# Altium schematic sheet Lamp Matrix and GI Driver.SchDoc
size A3 portrait; Organization: Altium Limited; Address1: L3, 12a Rodborough Rd; Address2: Frenchs Forest; Address3: NSW; Address4: Australia 2086
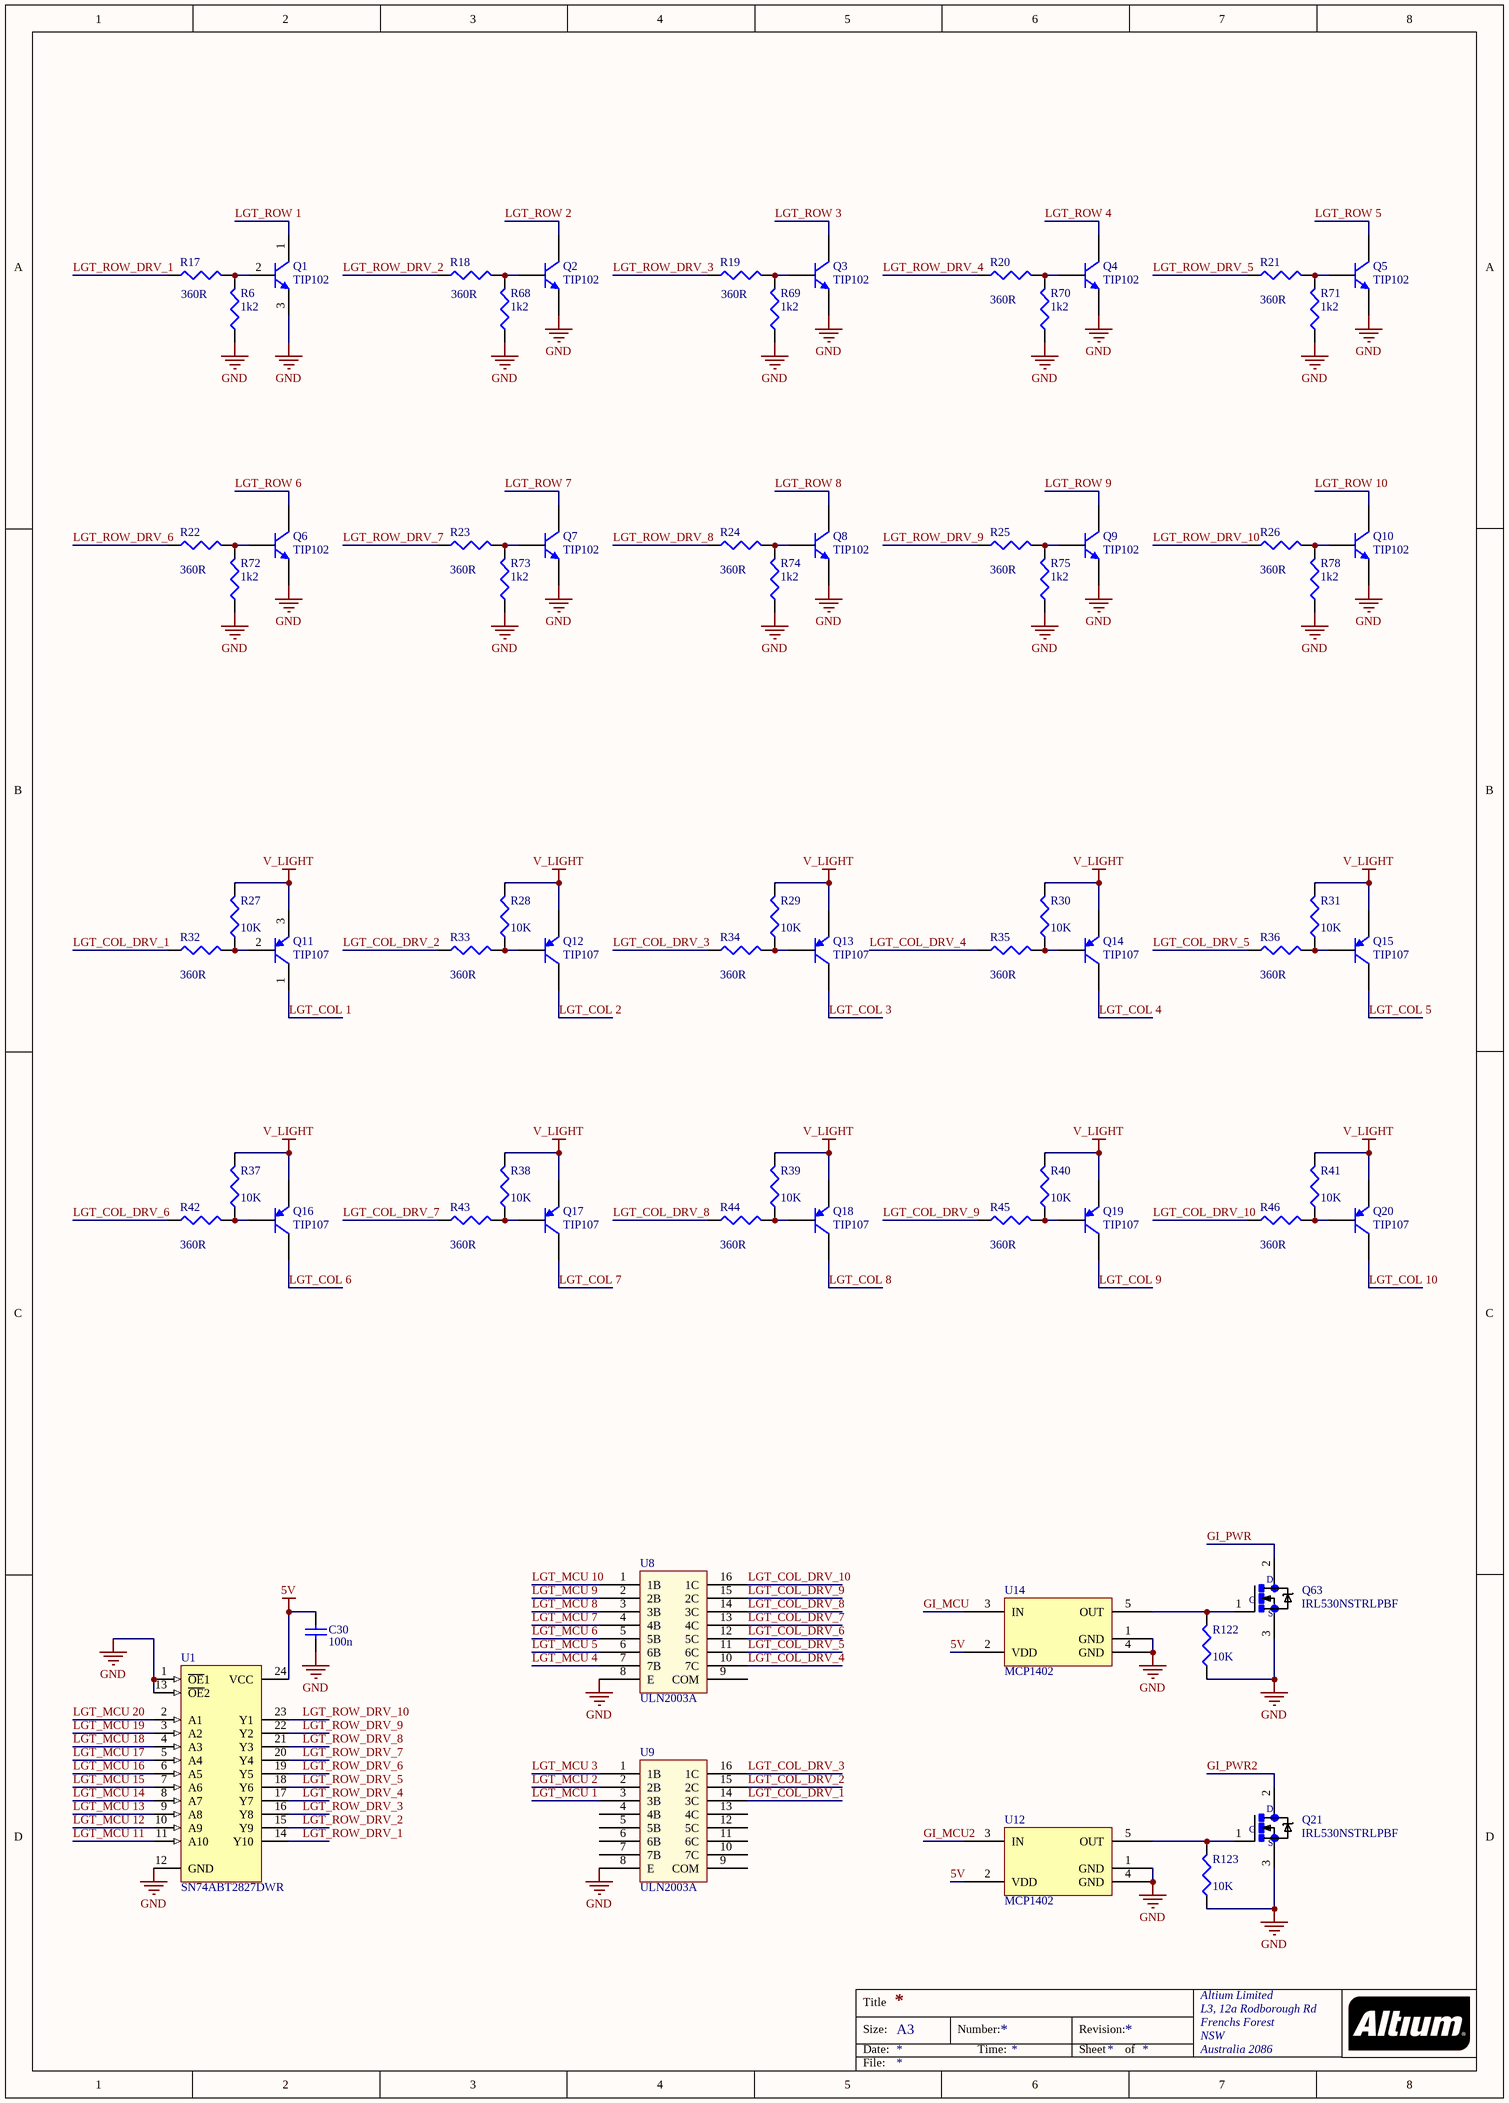
[diagram p0: Lamp Matrix and GI Driver.SchDoc]

## Parts
C30  value 100n  [0805C-GENERIC]  (hidden comment: Cap Semi)
Q1  TIP102  [TO-220AB]
Q2  TIP102  [TO-220AB]
Q3  TIP102  [TO-220AB]
Q4  TIP102  [TO-220AB]
Q5  TIP102  [TO-220AB]
Q6  TIP102  [TO-220AB]
Q7  TIP102  [TO-220AB]
Q8  TIP102  [TO-220AB]
Q9  TIP102  [TO-220AB]
Q10  TIP102  [TO-220AB]
Q11  TIP107  [TO-220AB]
Q12  TIP107  [TO-220AB]
Q13  TIP107  [TO-220AB]
Q14  TIP107  [TO-220AB]
Q15  TIP107  [TO-220AB]
Q16  TIP107  [TO-220AB]
Q17  TIP107  [TO-220AB]
Q18  TIP107  [TO-220AB]
Q19  TIP107  [TO-220AB]
Q20  TIP107  [TO-220AB]
Q21  IRL530NSTRLPBF  [TO-220AB]
Q63  IRL530NSTRLPBF  [TO-220AB]
R6  value 1k2  [0805R-GENERIC]  (hidden comment: Res3)
R17  value 360R  [0805R-GENERIC]  (hidden comment: Res3)
R18  value 360R  [0805R-GENERIC]  (hidden comment: Res3)
R19  value 360R  [0805R-GENERIC]  (hidden comment: Res3)
R20  value 360R  [0805R-GENERIC]  (hidden comment: Res3)
R21  value 360R  [0805R-GENERIC]  (hidden comment: Res3)
R22  value 360R  [0805R-GENERIC]  (hidden comment: Res3)
R23  value 360R  [0805R-GENERIC]  (hidden comment: Res3)
R24  value 360R  [0805R-GENERIC]  (hidden comment: Res3)
R25  value 360R  [0805R-GENERIC]  (hidden comment: Res3)
R26  value 360R  [0805R-GENERIC]  (hidden comment: Res3)
R27  value 10K  [0805R-GENERIC]  (hidden comment: Res3)
R28  value 10K  [0805R-GENERIC]  (hidden comment: Res3)
R29  value 10K  [0805R-GENERIC]  (hidden comment: Res3)
R30  value 10K  [0805R-GENERIC]  (hidden comment: Res3)
R31  value 10K  [0805R-GENERIC]  (hidden comment: Res3)
R32  value 360R  [0805R-GENERIC]  (hidden comment: Res3)
R33  value 360R  [0805R-GENERIC]  (hidden comment: Res3)
R34  value 360R  [0805R-GENERIC]  (hidden comment: Res3)
R35  value 360R  [0805R-GENERIC]  (hidden comment: Res3)
R36  value 360R  [0805R-GENERIC]  (hidden comment: Res3)
R37  value 10K  [0805R-GENERIC]  (hidden comment: Res3)
R38  value 10K  [0805R-GENERIC]  (hidden comment: Res3)
R39  value 10K  [0805R-GENERIC]  (hidden comment: Res3)
R40  value 10K  [0805R-GENERIC]  (hidden comment: Res3)
R41  value 10K  [0805R-GENERIC]  (hidden comment: Res3)
R42  value 360R  [0805R-GENERIC]  (hidden comment: Res3)
R43  value 360R  [0805R-GENERIC]  (hidden comment: Res3)
R44  value 360R  [0805R-GENERIC]  (hidden comment: Res3)
R45  value 360R  [0805R-GENERIC]  (hidden comment: Res3)
R46  value 360R  [0805R-GENERIC]  (hidden comment: Res3)
R68  value 1k2  [0805R-GENERIC]  (hidden comment: Res3)
R69  value 1k2  [0805R-GENERIC]  (hidden comment: Res3)
R70  value 1k2  [0805R-GENERIC]  (hidden comment: Res3)
R71  value 1k2  [0805R-GENERIC]  (hidden comment: Res3)
R72  value 1k2  [0805R-GENERIC]  (hidden comment: Res3)
R73  value 1k2  [0805R-GENERIC]  (hidden comment: Res3)
R74  value 1k2  [0805R-GENERIC]  (hidden comment: Res3)
R75  value 1k2  [0805R-GENERIC]  (hidden comment: Res3)
R78  value 1k2  [0805R-GENERIC]  (hidden comment: Res3)
R122  value 10K  [0805R-GENERIC]  (hidden comment: Res3)
R123  value 10K  [0805R-GENERIC]  (hidden comment: Res3)
U1  SN74ABT2827DWR  [SOIC24]
U8  ULN2003A  [SOIC16]
U9  ULN2003A  [SOIC16]
U12  MCP1402  [SOT23-5]
U14  MCP1402  [SOT23-5]

## Nets
5V: C30.2 U1.24(VCC) U12.2(VDD) U14.2(VDD)
GND: C30.1 Q1.3(E) Q2.3(E) Q3.3(E) Q4.3(E) Q5.3(E) Q6.3(E) Q7.3(E) Q8.3(E) Q9.3(E) Q10.3(E) Q21.3(S) Q63.3(S) R6.1 R68.1 R69.1 R70.1 R71.1 R72.1 R73.1 R74.1 R75.1 R78.1 R122.1 R123.1 U1.1(~{OE}1) U1.12(GND) U1.13(~{OE}2) U8.8(E) U9.8(E) U12.1(GND) U12.4(GND) U14.1(GND) U14.4(GND)
V_LIGHT: Q11.3(E) Q12.3(E) Q13.3(E) Q14.3(E) Q15.3(E) Q16.3(E) Q17.3(E) Q18.3(E) Q19.3(E) Q20.3(E) R27.2 R28.2 R29.2 R30.2 R31.2 R37.2 R38.2 R39.2 R40.2 R41.2
GI_MCU: U14.3(IN)
GI_MCU2: U12.3(IN)
GI_PWR: Q63.2(D)
GI_PWR2: Q21.2(D)
LGT_COL 1: Q11.1(C)
LGT_COL 2: Q12.1(C)
LGT_COL 3: Q13.1(C)
LGT_COL 4: Q14.1(C)
LGT_COL 5: Q15.1(C)
LGT_COL 6: Q16.1(C)
LGT_COL 7: Q17.1(C)
LGT_COL 8: Q18.1(C)
LGT_COL 9: Q19.1(C)
LGT_COL 10: Q20.1(C)
LGT_COL_DRV_1: R32.1 U9.14(3C)
LGT_COL_DRV_2: R33.1 U9.15(2C)
LGT_COL_DRV_3: R34.1 U9.16(1C)
LGT_COL_DRV_4: R35.1 U8.10(7C)
LGT_COL_DRV_5: R36.1 U8.11(6C)
LGT_COL_DRV_6: R42.1 U8.12(5C)
LGT_COL_DRV_7: R43.1 U8.13(4C)
LGT_COL_DRV_8: R44.1 U8.14(3C)
LGT_COL_DRV_9: R45.1 U8.15(2C)
LGT_COL_DRV_10: R46.1 U8.16(1C)
LGT_MCU 1: U9.3(3B)
LGT_MCU 2: U9.2(2B)
LGT_MCU 3: U9.1(1B)
LGT_MCU 4: U8.7(7B)
LGT_MCU 5: U8.6(6B)
LGT_MCU 6: U8.5(5B)
LGT_MCU 7: U8.4(4B)
LGT_MCU 8: U8.3(3B)
LGT_MCU 9: U8.2(2B)
LGT_MCU 10: U8.1(1B)
LGT_MCU 11: U1.11(A10)
LGT_MCU 12: U1.10(A9)
LGT_MCU 13: U1.9(A8)
LGT_MCU 14: U1.8(A7)
LGT_MCU 15: U1.7(A6)
LGT_MCU 16: U1.6(A5)
LGT_MCU 17: U1.5(A4)
LGT_MCU 18: U1.4(A3)
LGT_MCU 19: U1.3(A2)
LGT_MCU 20: U1.2(A1)
LGT_ROW 1: Q1.1(C)
LGT_ROW 2: Q2.1(C)
LGT_ROW 3: Q3.1(C)
LGT_ROW 4: Q4.1(C)
LGT_ROW 5: Q5.1(C)
LGT_ROW 6: Q6.1(C)
LGT_ROW 7: Q7.1(C)
LGT_ROW 8: Q8.1(C)
LGT_ROW 9: Q9.1(C)
LGT_ROW 10: Q10.1(C)
LGT_ROW_DRV_1: R17.1 U1.14(Y10)
LGT_ROW_DRV_2: R18.1 U1.15(Y9)
LGT_ROW_DRV_3: R19.1 U1.16(Y8)
LGT_ROW_DRV_4: R20.1 U1.17(Y7)
LGT_ROW_DRV_5: R21.1 U1.18(Y6)
LGT_ROW_DRV_6: R22.1 U1.19(Y5)
LGT_ROW_DRV_7: R23.1 U1.20(Y4)
LGT_ROW_DRV_8: R24.1 U1.21(Y3)
LGT_ROW_DRV_9: R25.1 U1.22(Y2)
LGT_ROW_DRV_10: R26.1 U1.23(Y1)
NetQ1_2: Q1.2(B) R6.2 R17.2
NetQ2_2: Q2.2(B) R18.2 R68.2
NetQ3_2: Q3.2(B) R19.2 R69.2
NetQ4_2: Q4.2(B) R20.2 R70.2
NetQ5_2: Q5.2(B) R21.2 R71.2
NetQ6_2: Q6.2(B) R22.2 R72.2
NetQ7_2: Q7.2(B) R23.2 R73.2
NetQ8_2: Q8.2(B) R24.2 R74.2
NetQ9_2: Q9.2(B) R25.2 R75.2
NetQ10_2: Q10.2(B) R26.2 R78.2
NetQ11_2: Q11.2(B) R27.1 R32.2
NetQ12_2: Q12.2(B) R28.1 R33.2
NetQ13_2: Q13.2(B) R29.1 R34.2
NetQ14_2: Q14.2(B) R30.1 R35.2
NetQ15_2: Q15.2(B) R31.1 R36.2
NetQ16_2: Q16.2(B) R37.1 R42.2
NetQ17_2: Q17.2(B) R38.1 R43.2
NetQ18_2: Q18.2(B) R39.1 R44.2
NetQ19_2: Q19.2(B) R40.1 R45.2
NetQ20_2: Q20.2(B) R41.1 R46.2
NetQ21_1: Q21.1(G) R123.2 U12.5(OUT)
NetQ63_1: Q63.1(G) R122.2 U14.5(OUT)

Not connected (* = marked no-connect by the designer): U8 9(COM); U9 4(4B) 5(5B) 6(6B) 7(7B) 9(COM) 10(7C) 11(6C) 12(5C) 13(4C)

## Notes on the sheet
- Title
- Size:
- Date:
- A3
- Number:
- Time:
- Revision:
- Sheet
- of
- File:

## Library data of the parts
C30 = Cap Semi: Capacitor (Semiconductor SIM Model); Published: 8-Jun-2000; LatestRevisionDate: 29-May-2009; LatestRevisionNote: IPC-7351 Footprint Added.; PackageReference: C1206; Publisher: Altium Limited; PackageDescription: Chip Capacitor
Q1-Q10 = NPN: NPN Bipolar Transistor; pin to pad: 1>2 2>1; Published: 8-Jun-2000; LatestRevisionDate: 17-Jul-2002; LatestRevisionNote: Re-released for DXP Platform.; PackageReference: TO-226-AA; Publisher: Altium Limited; PackageDescription: TO, Flat Index; 3 In-Line, Axial Leads; Body Dia. 4.8mm; Leads 0.55 x 0.51 mm (max); Code_JEDEC: TO-226-AA
Q11-Q20 = PNP: PNP Bipolar Transistor; pin to pad: 1>2 2>1; Published: 8-Jun-2000; LatestRevisionDate: 29-May-2009; LatestRevisionNote: IPC-7351 Footprint Added.; PackageVersion: Aug-1999; PackageReference: SOT-23B; Publisher: Altium Limited; PackageDescription: 3-Pin SOT-23 Package 0.95 mm Pitch, 2.4 mm Lead Span
Q21 Q63 = IRL530NSTRLPBF: MOSFET N-CH 100V 17A D2PAK; MF: Infineon; Price: 0.79 USD; Package: D2PAK Infineon; Availability: Good; MP: IRL530NSTRLPBF; Value: *
R6 R17-R46 R68-R75 R78 R122 R123 = Res3: Resistor; Published: 8-Jun-2000; LatestRevisionDate: 29-May-2009; LatestRevisionNote: IPC-7351 Footprint Added.; PackageReference: J1-0603; Publisher: Altium Limited; PackageDescription: Chip Resistor
U1 = SN74LVC827ADW: 10-Bit Buffer/Driver with 3-State Outputs; Published: 8-Jun-2000; LatestRevisionDate: 13-Apr-2006; LatestRevisionNote: IPC-7351 Footprint Added.; DatasheetVersion: Jun-1998; PackageVersion: Mar-2000; PackageReference: DW024; Publisher: Altium Limited; PackageDescription: 24-Pin Plastic Small Outline Integrated Circuit 1.27 mm Pitch; Code_JEDEC: MS-013; ComponentLink1Description: Manufacturer Link; ComponentLink1URL: http://www.ti.com/; ComponentLink2Description: Datasheet; ComponentLink2URL: http://www-s.ti.com/sc/ds/sn74lvc827a.pdf